# EasyEDA Pro project Sprig-C3 V1.0.1.epro, schematic Schematic2

## Sheets
1 Sheet_1: Board Name: Sprig-C6; Create Date: 2025-08-31; Page Name: Sheet_1; Project Name: ESP32-C3 module_2024-02-14_10-07-03; Schematic Name: Schematic2; Update Date: 2025-08-31; Company: EasyEDA.com; Page Size: A4; Version: V1.0
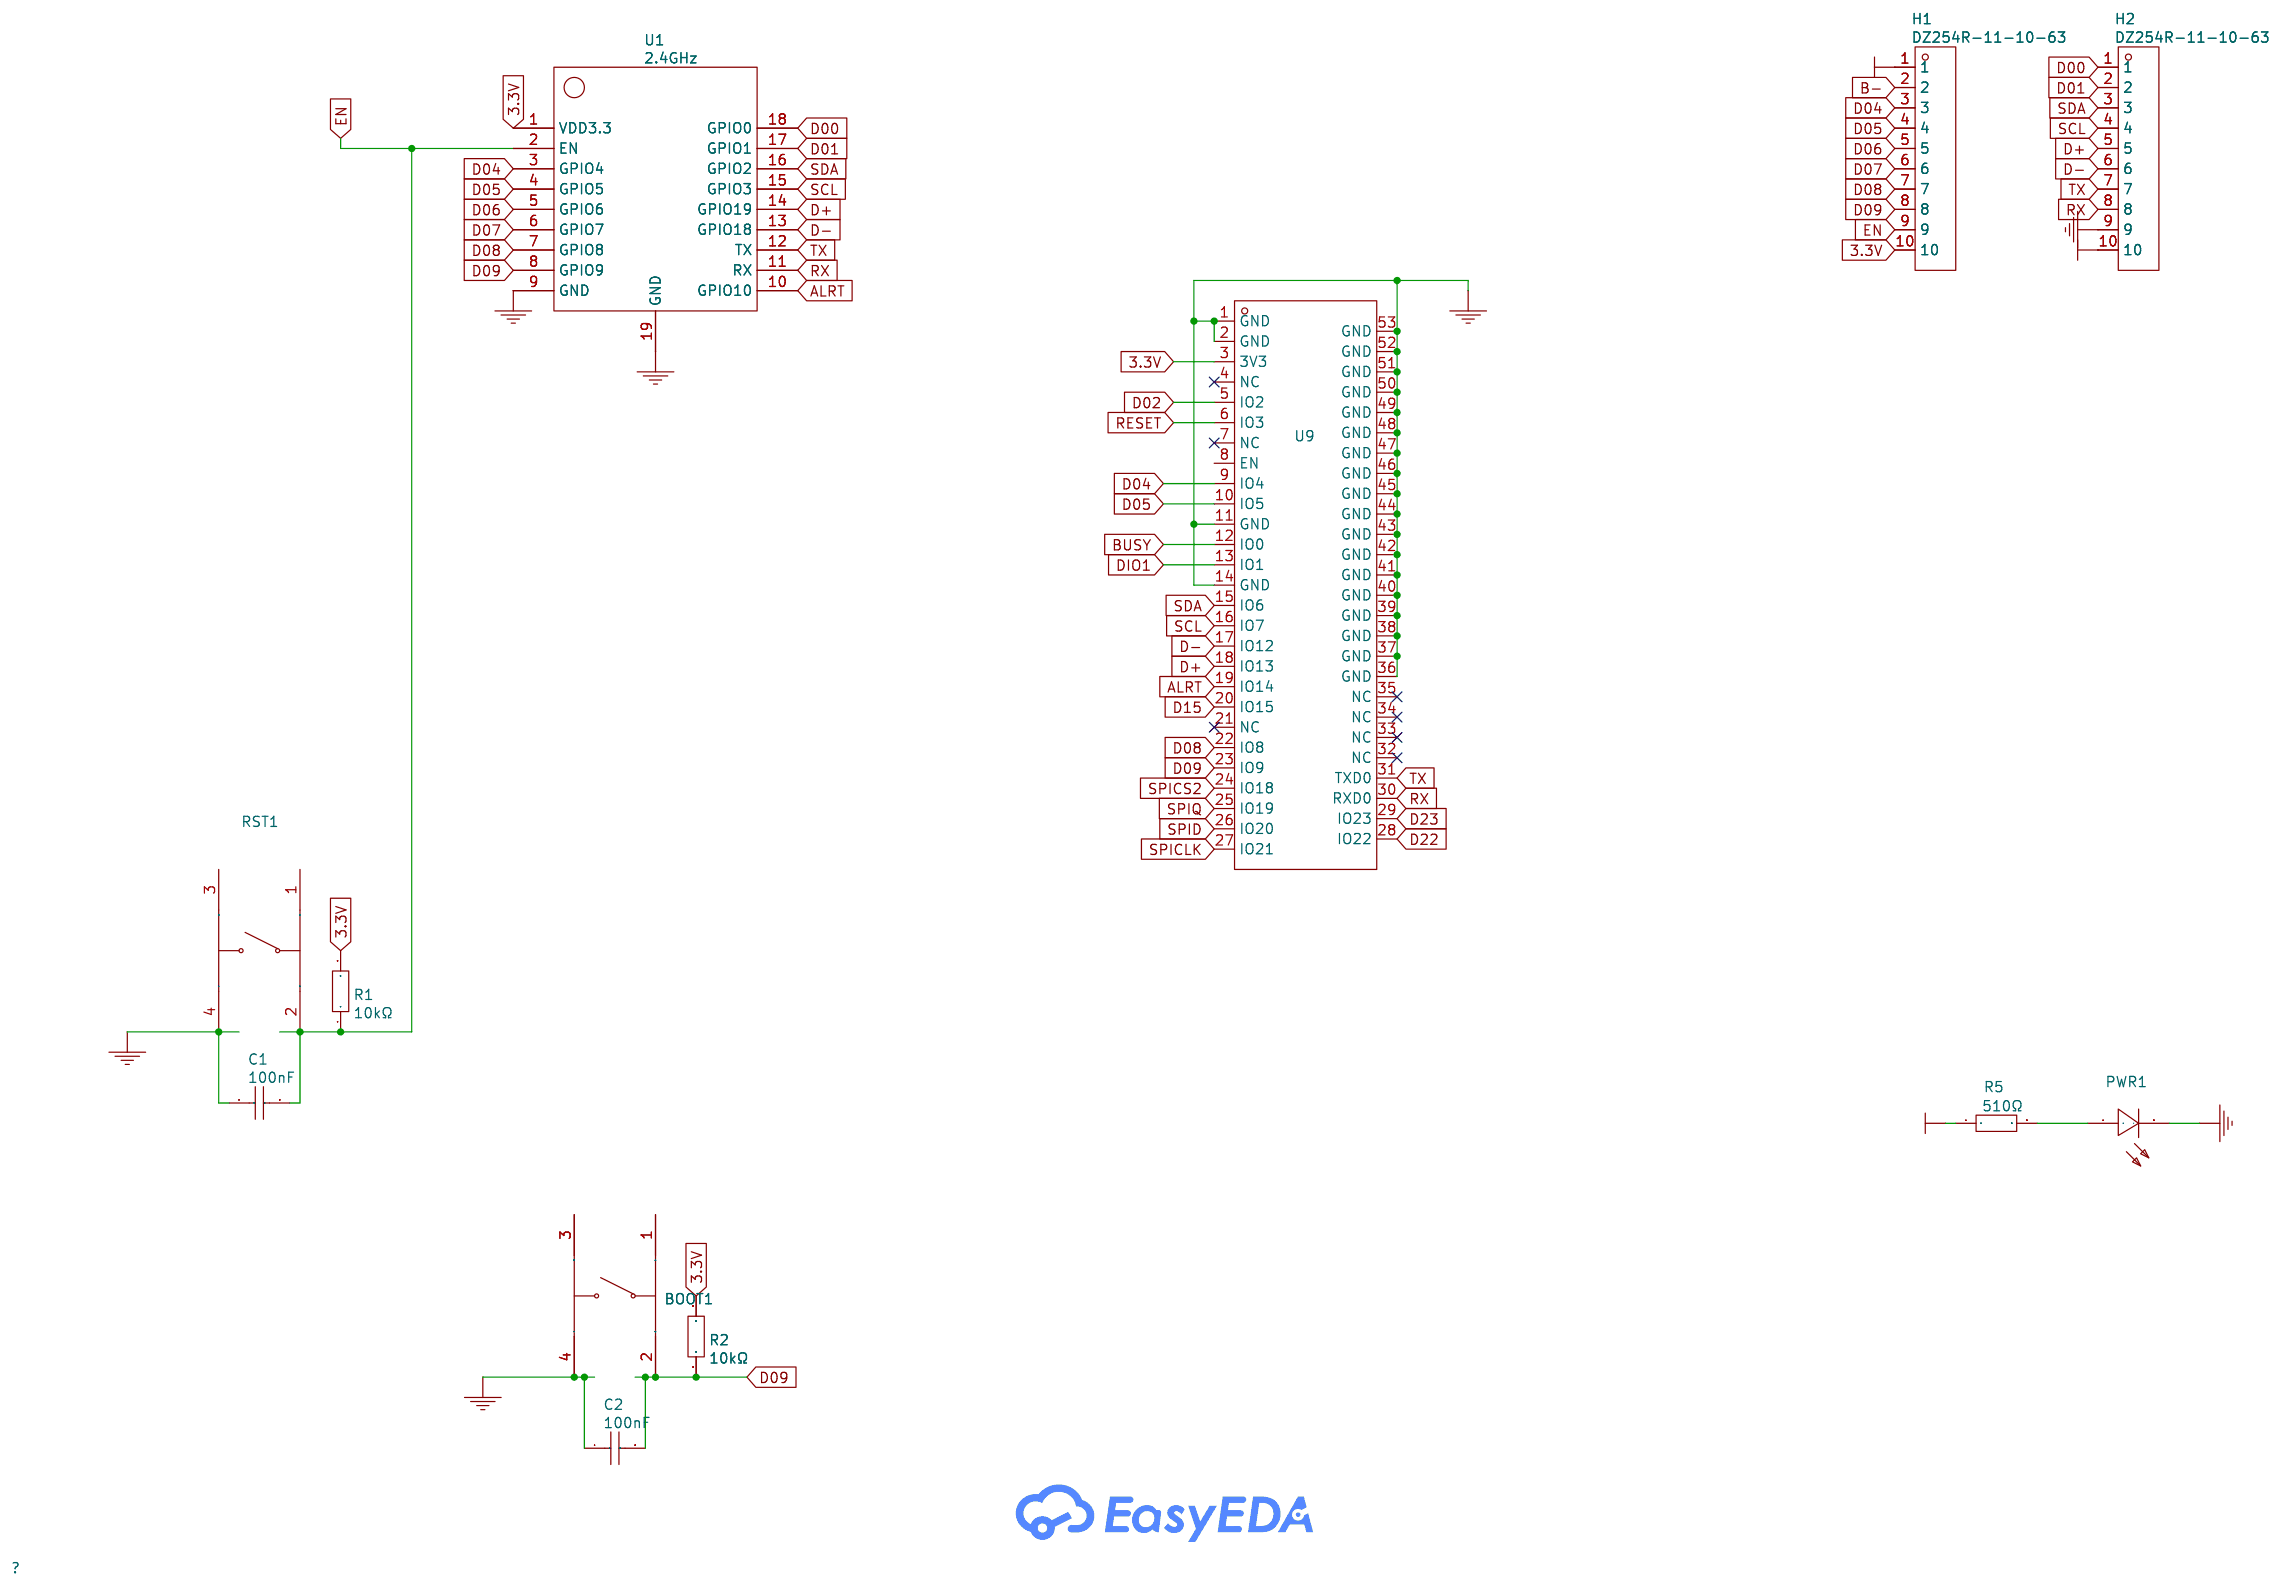
[diagram p4: Sheet_1]
2 Power: Page Name: Power
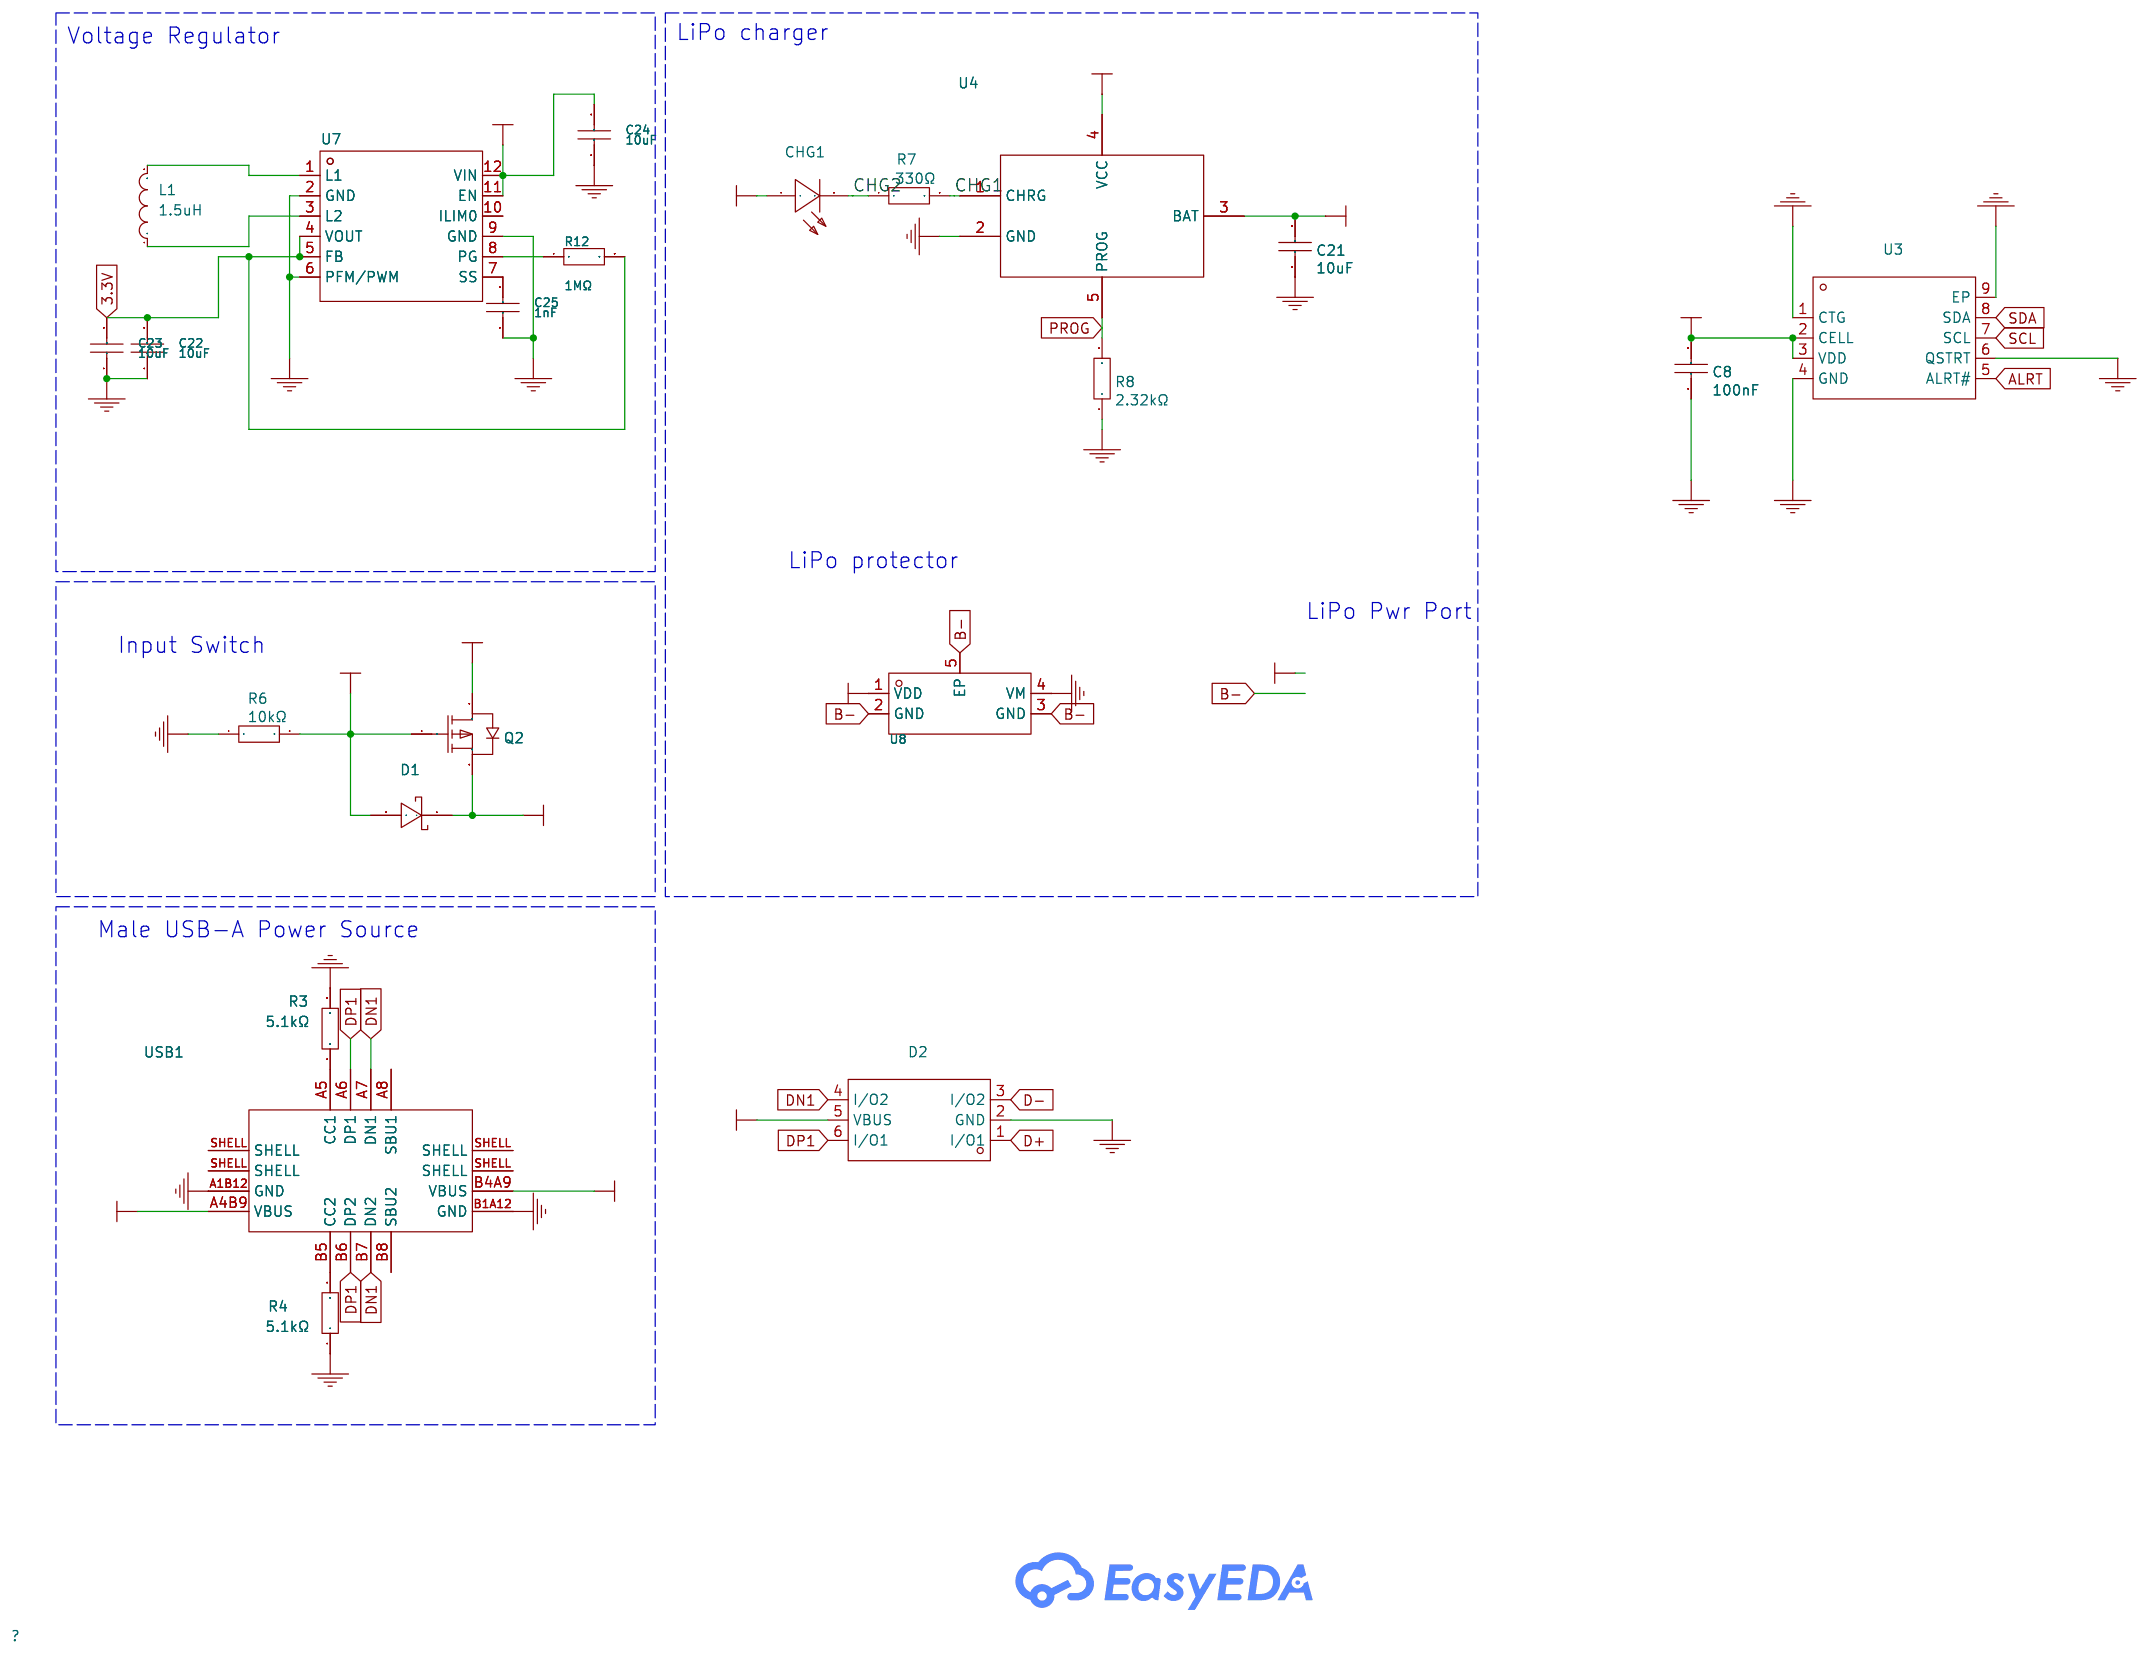
[diagram p5: Power]

## Parts
sheet Power
C8  100nF  [C0402]
C21  10uF  [C0402]
C22  10uF  [C0402]
C23  10uF  [C0402]
C24  10uF  [C0402]
C25  1nF  [C0402]
CHG1  MHT192CSCT  [LED0603-R-RD_ORANGE]
D1  B5819W SL  [SOD-123_L2.7-W1.6-LS3.7-RD-1]
D2  USBLC6-2P6  [SOT-666-6_L1.6-W1.2-P0.50-LS1.6-BL]
L1  1.5uH  [L0806]
Q2  AO3401A  [SOT-23_L2.9-W1.3-P1.90-LS2.4-BR]
R3  5.1kΩ  [R0402]
R4  5.1kΩ  [R0402]
R6  10kΩ  [R0402]
R7  330Ω  [R0402]
R8  2.32kΩ  [R0402]
R12  1MΩ  [R0402]
U3  MAX17048G+T10  [DFN-8_L2.0-W2.0-P0.50-BL-EP]
U4  TP4065-4.2V-SOT25-R  [SOT-23-5_L3.0-W1.7-P0.95-LS2.8-BR]
U7  TPS63051RMWR  [QFN-12_L2.5-W2.5-P0.50-TL]
U8  AP6683  [DFN-4_L1.0-W1.0-P0.65-BL-EP]
USB1  U262-161N-4BVC11  [USB-3.1-SMD_U262-161N-4BVC11]
sheet Sheet_1
BOOT1  TSA016A2518C  [SW-SMD_4P-L4.2-W3.3-P2.15-LS4.6]
C1  100nF  [C0402]
C2  100nF  [C0402]
H1  DZ254R-11-10-63  [HDR-TH_10P-P2.54-V-M]
H2  DZ254R-11-10-63  [HDR-TH_10P-P2.54-V-M]
PWR1  E6C0603CWAY1UDA  [LED0603-R-RD_WHITE]
R1  10kΩ  [R0402]
R2  10kΩ  [R0402]
R5  510Ω  [R0402]
RST1  TSA016A2518C  [SW-SMD_4P-L4.2-W3.3-P2.15-LS4.6]
U1  2.4GHz  [BULETM-SMD_ESPRESSIF_ESP32-C3-WROOM-02-N4-4MB]
U9  ESP32-C6-MINI-1-N4  [WIFIM-SMD_61P-L16.6-W13.2-P0.80-ESP32-C6-MINI-1-N4]

## Library data of the parts
C1 C2 C8 = 0402B104K160NT: Capacitance:100nF Tolerance:±10% Tolerance:±10% Voltage Rated: Temperature Coefficient:; LCSC Part Name: 100nF ±10% 16V; Supplier Part: C41851; Manufacturer: FH(风华); Supplier Footprint: 0402; JLCPCB Part Class: Extended Part; Datasheet: https://atta.szlcsc.com/upload/public/pdf/source/20200305/C486355_26A10D38EF8C2A5C37091D0039909270.pdf; Supplier: LCSC; Tolerance: ±10%
C21-C24 = CL05A106MQ5NUNC: Capacitance: Tolerance:±20% Tolerance:±20% Voltage Rated: Temperature Coefficient:; LCSC Part Name: 10uF ±20% 6.3V; Supplier Part: C15525; Manufacturer: SAMSUNG(三星); Supplier Footprint: 0402; JLCPCB Part Class: Basic Part; Datasheet: https://atta.szlcsc.com/upload/public/pdf/source/20220823/2B02EE04F8F211D38A52DCB16EB6BEBA.pdf; Supplier: LCSC; Tolerance: ±20%
C25 = CC0402KRX7R9BB102: Capacitance: Tolerance:±10% Tolerance:±10% Voltage Rated: Temperature Coefficient:; LCSC Part Name: 1nF ±10% 50V; Supplier Part: C106205; Manufacturer: YAGEO(国巨); Supplier Footprint: 0402; JLCPCB Part Class: Extended Part; Datasheet: https://atta.szlcsc.com/upload/public/pdf/source/20181008/C309510_22F155564471FAF6A489F7D68F34234E.pdf; Supplier: LCSC; Tolerance: ±10%
CHG1 = MHT192CSCT: Emitted Color:Orange Power Dissipation:60mW Forward Current:20mA Dominant Wavelength:597.5nm~609.5nm Dominant Wavelength:597.5nm~609.5nm Peak Wavelength:611nm Diode Configuration:- Lens Color:无色透明透镜 Color Temperature:- Color Temperature:- Viewing Angle:12; LCSC Part Name: 橙灯; Supplier Part: C401116; Manufacturer: MEIHUA(美华); Supplier Footprint: 0603; JLCPCB Part Class: Extended Part; Datasheet: https://atta.szlcsc.com/upload/public/pdf/source/20190702/C401116_352EE2AFCDF8A648729C25765353F625.pdf; Supplier: LCSC; Emitted Color: Orange; Power Dissipation: 60mW; Forward Current: 20mA; Dominant Wavelength: 597.5nm~609.5nm; Peak Wavelength: 611nm; Lens Color: 无色透明透镜; Viewing Angle: 120°; Operating Temperature: -35℃~+85℃
D1 = B5819W SL: Forward Voltage (Vf@If):600mV@1A Reverse Voltage (Vr):40V Average Rectified Current (Io):1A; LCSC Part Name: 电压:40V 电流:1A; Supplier Part: C8598; Manufacturer: CJ(江苏长电/长晶); Supplier Footprint: SOD-123; JLCPCB Part Class: Basic Part; Datasheet: https://atta.szlcsc.com/upload/public/pdf/source/20171228/C164911_15144413243851213914.pdf; Supplier: LCSC; Forward Voltage (Vf@If): 600mV@1A; Reverse Voltage (Vr): 40V; Average Rectified Current (Io): 1A
D2 = USBLC6-2P6: Type:ESD; LCSC Part Name: MSL=3; Supplier Part: C2827693; Manufacturer: TECH PUBLIC(台舟); Supplier Footprint: SOT-666-6; JLCPCB Part Class: Extended Part; Datasheet: https://atta.szlcsc.com/upload/public/pdf/source/20210810/36353A9194EA9F4E33F8AE18BE051AEA.pdf; Supplier: LCSC; Type: ESD
L1 = DFE201610E-1R5M=P2: Inductance: Tolerance:±20% Tolerance:±20% Rated Current:- Saturation Current (Isat):- DC Resistance (DCR):- Ratings:-; LCSC Part Name: 1.5uH ±20%; Supplier Part: C668311; Manufacturer: muRata(村田); Supplier Footprint: 0806; JLCPCB Part Class: Extended Part; Datasheet: https://atta.szlcsc.com/upload/public/pdf/source/20190513/C337891_E8F53E7A275D0CF4365E41AA9943B04D.pdf; Supplier: LCSC; Tolerance: ±20%
Q2 = AO3401A_C15127: Type: Drain Source Voltage (Vdss): Continuous Drain Current (Id): Power Dissipation (Pd): Drain Source On Resistance (RDS(on)@Vgs,Id):44mΩ@10V,4.3A Gate Threshold Voltage (Vgs(th)@Id):1.3V@250uA Total Gate Charge (Qg@Vgs):12.2nC@4.5V Input Capacitance (Ci; LCSC Part Name: P沟道 耐压:30V 电流:4A; Supplier Part: C15127; Manufacturer: AOS; Supplier Footprint: SOT-23; JLCPCB Part Class: Basic Part; Datasheet: https://atta.szlcsc.com/upload/public/pdf/source/20160507/1462613609053.pdf; Supplier: LCSC; Drain Source On Resistance (RDS(on)@Vgs,Id): 44mΩ@10V,4.3A; Gate Threshold Voltage (Vgs(th)@Id): 1.3V@250uA; Total Gate Charge (Qg@Vgs): 12.2nC@4.5V; Input Capacitance (Ciss@Vds): 1.2nF@15V; Operating Temperature: -55℃~+150℃@(Tj); image: //image.lceda.cn/szlcsc/C15127.jpg
R3 R4 = 0402WGJ0512TCE: Type:Thick Film Resistors Resistance:5.1kΩ Tolerance:±5% Tolerance:±5% Power(Watts): Overload Voltage (Max): Temperature Coefficient:±100ppm/℃ Temperature Coefficient:±100ppm/℃ Operating Temperature Range:-55℃~+155℃ Operating Temperature Range:-55℃~+155℃; LCSC Part Name: 5.1kΩ ±5% 62.5mW 厚膜电阻; Supplier Part: C25941; Manufacturer: UNI-ROYAL(厚声); Supplier Footprint: 0402; JLCPCB Part Class: Extended Part; Datasheet: https://atta.szlcsc.com/upload/public/pdf/source/20200306/C422600_1E6D84923E4A46A82E41ADD87F860B5C.pdf; Supplier: LCSC; Type: Thick Film Resistors; Tolerance: ±5%; Temperature Coefficient: ±100ppm/℃; Operating Temperature Range: -55℃~+155℃; Resistance: 5.1K
R6 = RMS04FT1002: Type:Thick Film Resistors Resistance: Tolerance:±1% Tolerance:±1% Power(Watts): Overload Voltage (Max): Temperature Coefficient:±100ppm/℃ Temperature Coefficient:±100ppm/℃ Operating Temperature Range:-55℃~+155℃ Operating Temperature Range:-55℃~+155℃; LCSC Part Name: 厚膜电阻 10kΩ ±1% 62.5mW; Supplier Part: C208775; Manufacturer: 大毅科技; Supplier Footprint: 0402; JLCPCB Part Class: Extended Part; Datasheet: https://atta.szlcsc.com/upload/public/pdf/source/20190313/C209057_DB28D2F9A2E1A0AF6BB7AAA99A28D7CC.pdf; Supplier: LCSC; Type: Thick Film Resistors; Tolerance: ±1%; Temperature Coefficient: ±100ppm/℃; Operating Temperature Range: -55℃~+155℃
R7 = 0402WGF3300TCE: Type:Thick Film Resistors Resistance: Tolerance:±1% Tolerance:±1% Power(Watts): Overload Voltage (Max): Temperature Coefficient:±100ppm/℃ Temperature Coefficient:±100ppm/℃ Operating Temperature Range:-55℃~+155℃ Operating Temperature Range:-55℃~+155℃; LCSC Part Name: 330Ω ±1% 62.5mW 厚膜电阻; Supplier Part: C25104; Manufacturer: UNI-ROYAL(厚声); Supplier Footprint: 0402; JLCPCB Part Class: Basic Part; Datasheet: https://atta.szlcsc.com/upload/public/pdf/source/20200306/C422600_1E6D84923E4A46A82E41ADD87F860B5C.pdf; Supplier: LCSC; Type: Thick Film Resistors; Tolerance: ±1%; Temperature Coefficient: ±100ppm/℃; Operating Temperature Range: -55℃~+155℃
R8 = WR04X2321FTL: Type:Thick Film Resistors Resistance: Tolerance:±1% Tolerance:±1% Power(Watts): Overload Voltage (Max): Temperature Coefficient:±100ppm/℃ Temperature Coefficient:±100ppm/℃ Operating Temperature Range:-55℃~+155℃ Operating Temperature Range:-55℃~+155℃; LCSC Part Name: 厚膜电阻 2.32kΩ ±1% 62.5mW; Supplier Part: C334666; Manufacturer: Walsin(华新科); Supplier Footprint: 0402; JLCPCB Part Class: Extended Part; Datasheet: https://atta.szlcsc.com/upload/public/pdf/source/20191217/C470037_D99261402F77DA8B1D609223749D445A.pdf; Supplier: LCSC; Type: Thick Film Resistors; Tolerance: ±1%; Temperature Coefficient: ±100ppm/℃; Operating Temperature Range: -55℃~+155℃
R12 = 0402WGF1004TCE: Type:Thick Film Resistors Resistance:1MΩ Tolerance:±1% Tolerance:±1% Power(Watts): Overload Voltage (Max): Temperature Coefficient:±100ppm/℃ Temperature Coefficient:±100ppm/℃ Operating Temperature Range:-55℃~+155℃ Operating Temperature Range:-55℃~+155℃; LCSC Part Name: 1MΩ ±1% 62.5mW 厚膜电阻; Supplier Part: C26083; Manufacturer: UNI-ROYAL(厚声); Supplier Footprint: 0402; JLCPCB Part Class: Basic Part; Datasheet: https://atta.szlcsc.com/upload/public/pdf/source/20200306/C422600_1E6D84923E4A46A82E41ADD87F860B5C.pdf; Supplier: LCSC; Type: Thick Film Resistors; Tolerance: ±1%; Temperature Coefficient: ±100ppm/℃; Operating Temperature Range: -55℃~+155℃
U3 = MAX17048G+T10: The Chip Type:电池监测芯片 Type of Battery:锂离子/Polymer Number of Cells:1 Number of Cells:1 Operating Temperature:-20℃~+70℃ Operating Temperature:-20℃~+70℃; Supplier Part: C2682616; Manufacturer: ADI(亚德诺)/MAXIM(美信); Supplier Footprint: DFN-8-EP(2x2); JLCPCB Part Class: Extended Part; Datasheet: https://atta.szlcsc.com/upload/public/pdf/source/20210106/C2682616_818568B5D3BA4B627110FCAA33E0BFB1.pdf; Supplier: LCSC; The Chip Type: 电池监测芯片; Type of Battery: 锂离子/Polymer; Number of Cells: 1; Operating Temperature: -20℃~+70℃; link: https://lcsc.com/eda_search?q=C2682616&amp;%26type=1&amp;ref=editor
U4 = TP4065-4.2V-SOT25-R: Supplier Part: C113540; Manufacturer: TOPPOWER(南京拓微); Supplier Footprint: SOT-23-5; JLCPCB Part Class: Extended Part; Datasheet: https://atta.szlcsc.com/upload/public/pdf/source/20170601/1496302453692.pdf; Supplier: LCSC
U7 = TPS63051RMWR: Function:Buck-boost type Output Type:Fixed Input Voltage:2.5V~5.5V Input Voltage:2.5V~5.5V Output Voltage:3.3V Output Voltage:3.3V Output Current (Max):500mA Switching Frequency:2.5MHz Operating Temperature:-40℃~+85℃@(TA) Operating Temperature:-40℃~+85℃@(; Supplier Part: C139412; Manufacturer: TI(德州仪器); Supplier Footprint: QFN-12(2.5x2.5); JLCPCB Part Class: Extended Part; Datasheet: https://www.ti.com/cn/lit/gpn/tps63051; Supplier: LCSC; Function: Buck-boost type; Output Type: Fixed; Input Voltage: 2.5V~5.5V; Output Voltage: 3.3V; Output Current (Max): 500mA; Switching Frequency: 2.5MHz; Operating Temperature: -40℃~+85℃@(TA); Synchronous Rectification: Yes; Number of Outputs: 1; Topology: Step-down-Boost; Switch tube (built-in/external): 内置
U8 = AP6683: Supplier Part: C2849565; Manufacturer: ALLPOWER(铨力); Supplier Footprint: DFN-4-EP(1x1); JLCPCB Part Class: Extended Part; Datasheet: https://atta.szlcsc.com/upload/public/pdf/source/20210723/C2849565_EA604836CC73D2108C5387801D1EBC6A.pdf; Supplier: LCSC
USB1 = U262-161N-4BVC11: Connector Type:Type-C Standard:USB 3.1 Gender:Female Number of Ports:1 Number of Contacts:16P Mounting Style:卧贴 Current Rating - Power (Max):3A Contact Material:Copper Alloy Contact Plating:Gold Operating Temperature Range:-40℃~+85℃ Operating Temperature; LCSC Part Name: Type-C 母 卧贴; Supplier Part: C319148; Manufacturer: XKB Connectivity(中国星坤); Supplier Footprint: SMD; JLCPCB Part Class: Extended Part; Datasheet: https://atta.szlcsc.com/upload/public/pdf/source/20211015/B478CBA0F1623DA36A6CC6918C49C838.pdf; Supplier: LCSC; Connector Type: Type-C; Standard: USB 3.1; Gender: Female; Number of Ports: 1; Number of Contacts: 16P; Mounting Style: 卧贴; Current Rating - Power (Max): 3A; Contact Material: Copper Alloy; Contact Plating: Gold; Operating Temperature Range: -40℃~+85℃; Soldering Temperature(Max): 260℃
BOOT1 RST1 = TSA016A2518C: Actuator Style:Oval button Operating Force:180gf Mounting Style:Brick nogging Switch Length:4.2mm Switch Width:3.35mm Switch Height:2.5mm Contact Current:50mA Voltage Rating (AC):- Voltage Rating (DC):12V Actuator/Cap Color:White Mechanical Life:-; LCSC Part Name: 4.2*3.35*2.5mm 立贴 轻触开关; Supplier Part: C2888430; Manufacturer: BZCN(博众电气); Supplier Footprint: SMD; JLCPCB Part Class: Extended Part; Datasheet: https://atta.szlcsc.com/upload/public/pdf/source/20210906/0198B859780D4FA617E4EB862D7350E5.pdf; Supplier: LCSC; Actuator Style: Oval button; Operating Force: 180gf; Mounting Style: Brick nogging; Switch Length: 4.2mm; Switch Width: 3.35mm; Switch Height: 2.5mm; Contact Current: 50mA; Voltage Rating (DC): 12V; Actuator/Cap Color: White
H1 H2 = DZ254R-11-10-63: Supplier: LCSC; Supplier Part: C2935916; Manufacturer: DEALON(德艺隆); JLCPCB Part Class: Extended Part
PWR1 = E6C0603CWAY1UDA: Emitted Color:White Power Dissipation:- Forward Current:- Dominant Wavelength:- Dominant Wavelength:- Peak Wavelength:- Diode Configuration:- Lens Color:雾状黄透镜 Color Temperature:- Color Temperature:- Viewing Angle:120° Mounting Sytle:- Operating Temperatur; LCSC Part Name: 白灯; Supplier Part: C375448; Manufacturer: ekinglux(亿晶源); Supplier Footprint: 0603; JLCPCB Part Class: Extended Part; Datasheet: https://atta.szlcsc.com/upload/public/pdf/source/20220330/61767F200BF18CBF3CD3534B46D80FD9.pdf; Supplier: LCSC; Emitted Color: White; Lens Color: 雾状黄透镜; Viewing Angle: 120°; Operating Temperature: -40℃~+90℃
R1 R2 = RMS04FT1002: Type:Thick Film Resistors Resistance: Tolerance:±1% Tolerance:±1% Power(Watts): Overload Voltage (Max): Temperature Coefficient:±100ppm/℃ Temperature Coefficient:±100ppm/℃ Operating Temperature Range:-55℃~+155℃ Operating Temperature Range:-55℃~+155℃; LCSC Part Name: 厚膜电阻 10kΩ ±1% 62.5mW; Supplier Part: C208775; Manufacturer: 大毅科技; Supplier Footprint: 0402; JLCPCB Part Class: Extended Part; Datasheet: https://atta.szlcsc.com/upload/public/pdf/source/20190313/C209057_DB28D2F9A2E1A0AF6BB7AAA99A28D7CC.pdf; Supplier: LCSC; Type: Thick Film Resistors; Tolerance: ±1%; Temperature Coefficient: ±100ppm/℃; Operating Temperature Range: -55℃~+155℃; link: https://lcsc.com/eda_search?q=C208775&amp;%26type=1&amp;ref=editor
R5 = 0402WGF5100TCE: Type:Thick Film Resistors Resistance: Tolerance:±1% Tolerance:±1% Power(Watts): Overload Voltage (Max): Temperature Coefficient:±100ppm/℃ Temperature Coefficient:±100ppm/℃ Operating Temperature Range:-55℃~+155℃ Operating Temperature Range:-55℃~+155℃; LCSC Part Name: 510Ω ±1% 62.5mW 厚膜电阻; Supplier Part: C25123; Manufacturer: UNI-ROYAL(厚声); Supplier Footprint: 0402; JLCPCB Part Class: Basic Part; Datasheet: https://atta.szlcsc.com/upload/public/pdf/source/20200306/C422600_1E6D84923E4A46A82E41ADD87F860B5C.pdf; Supplier: LCSC; Type: Thick Film Resistors; Tolerance: ±1%; Temperature Coefficient: ±100ppm/℃; Operating Temperature Range: -55℃~+155℃
U1 = ESP32-C3-WROOM-02-N4_C2934560: Core Processor:ESP32-C3芯片 Support Interface:I2C；GPIO；SPI；JTAG；UART；USB；I2S Frequency:2.4GHz Output Power:20.5dBm Output Power:20.5dBm; LCSC Part Name: ESP32-C3-WROOM-02-N4; Supplier Part: C2934560; Manufacturer: ESPRESSIF(乐鑫); Manufacturer Part: ESP32-C3-WROOM-02-N4; Supplier Footprint: VFQFN-32-EP; JLCPCB Part Class: Extended Part; Datasheet: https://atta.szlcsc.com/upload/public/pdf/source/20220106/F07459EFFE1D7CBA94B4FB8A075146A6.pdf; Supplier: LCSC; Core Processor: ESP32-C3芯片; Support Interface: I2C；GPIO；SPI；JTAG；UART；USB；I2S; Output Power: 20.5dBm; link: https://www.digikey.ca/en/products/detail/espressif-systems/ESP32-C3-WROOM-02-N4/14553031
U9 = ESP32-C6-MINI-1-N4: Supplier Part: C5736265; Manufacturer: ESPRESSIF(乐鑫); Supplier Footprint: SMD-53P; JLCPCB Part Class: Extended Part; Datasheet: https://atta.szlcsc.com/upload/public/pdf/source/20241030/4F3760582B039FB0FD0E1D65FBCFB6F4.pdf; Supplier: LCSC

## Nets
3.3V: C22.2 C23.2 H1.10 R1.2 R2.2 R12.2 U1.1(VDD3.3) U7.4(VOUT) U7.5(FB) U9.3(3V3)
GND: BOOT1.4 C1.1 C2.1 C8.1 C21.1 C22.1 C23.1 C24.1 C25.1 D2.2(GND) H2.9 PWR1.2(-) R3.2 R4.1 R6.1 R8.1 RST1.4 U1.9(GND) U1.19(GND) U3.1(CTG) U3.4(GND) U3.6(QSTRT) U3.9(EP) U4.2(GND) U7.2(GND) U7.6(PFM/PWM) U7.9(GND) U8.4(VM) U9.1(GND) U9.2(GND) U9.11(GND) U9.14(GND) U9.36(GND) U9.37(GND) U9.38(GND) U9.39(GND) U9.40(GND) U9.41(GND) U9.42(GND) U9.43(GND) U9.44(GND) U9.45(GND) U9.46(GND) U9.47(GND) U9.48(GND) U9.49(GND) U9.50(GND) U9.51(GND) U9.52(GND) U9.53(GND) USB1.A1B12(GND) USB1.B1A12(GND)
VBAT: C8.2 C21.2 H1.1 Q2.3(D) U3.2(CELL) U3.3(VDD) U4.3(BAT) U8.1(VDD)
VCC: CHG1.1(A) D1.2(+) D2.5(VBUS) H2.10 Q2.1(G) R5.1 R6.2 U4.4(VCC) USB1.A4B9(VBUS) USB1.B4A9(VBUS)
VIN: C24.2 D1.1(-) Q2.2(S) U7.11(EN) U7.12(VIN)
ALRT: U1.10(GPIO10) U3.5(ALRT#) U9.19(IO14)
B-: H1.2 U8.2(GND) U8.3(GND) U8.5(EP)
BUSY: U9.12(IO0)
CHG1: R7.2 U4.1(CHRG)
CHG2: CHG1.2(K) R7.1
D00: H2.1 U1.18(GPIO0)
D01: H2.2 U1.17(GPIO1)
D02: U9.5(IO2)
D04: H1.3 U1.3(GPIO4) U9.9(IO4)
D05: H1.4 U1.4(GPIO5) U9.10(IO5)
D06: H1.5 U1.5(GPIO6)
D07: H1.6 U1.6(GPIO7)
D08: H1.7 U1.7(GPIO8) U9.22(IO8)
D09: BOOT1.2 C2.2 H1.8 R2.1 U1.8(GPIO9) U9.23(IO9)
D15: U9.20(IO15)
D22: U9.28(IO22)
D23: U9.29(IO23)
D+: D2.1(I/O1) H2.5 U1.14(GPIO19) U9.18(IO13)
D-: D2.3(I/O2) H2.6 U1.13(GPIO18) U9.17(IO12)
DIO1: U9.13(IO1)
DN1: D2.4(I/O2) USB1.A7(DN1) USB1.B7(DN2)
DP1: D2.6(I/O1) USB1.A6(DP1) USB1.B6(DP2)
EN: C1.2 H1.9 R1.1 RST1.2 U1.2(EN)
PROG: R8.2 U4.5(PROG)
RESET: U9.6(IO3)
RX: H2.8 U1.11(RX) U9.30(RXD0)
SCL: H2.4 U1.15(GPIO3) U3.7(SCL) U9.16(IO7)
SDA: H2.3 U1.16(GPIO2) U3.8(SDA) U9.15(IO6)
SPICLK: U9.27(IO21)
SPICS2: U9.24(IO18)
SPID: U9.26(IO20)
SPIQ: U9.25(IO19)
TX: H2.7 U1.12(TX) U9.31(TXD0)
$1N1977: PWR1.1(+) R5.2
$2N1502: R3.1 USB1.A5(CC1)
$2N1504: R4.2 USB1.B5(CC2)
$2N1513: L1.1 U7.3(L2)
$2N1514: L1.2 U7.1(L1)
$2N1518: R12.1 U7.8(PG)
$2N1521: C25.2 U7.7(SS)

Not connected (* = marked no-connect by the designer): BOOT1 1 3; RST1 1 3; U7 10(ILIM0); U9 4(NC)* 7(NC)* 8(EN) 21(NC)* 32(NC)* 33(NC)* 34(NC)* 35(NC)*; USB1 A8(SBU1) B8(SBU2) SHELL

## Notes on the sheets
sheet 2
- Voltage Regulator
- LiPo charger
- LiPo protector
- LiPo Pwr Port
- Input Switch
- Male USB-A Power Source
